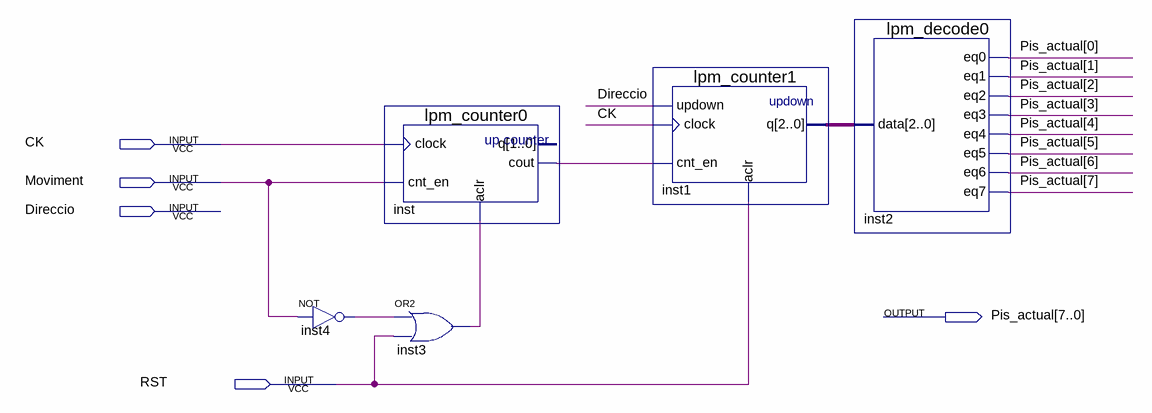
[diagram p0: schematic sheet]
// Quartus schematic Pis.bdf as structural Verilog: 5 symbols, 5 pins
module Pis (
  input  CK,
  input  Moviment,
  input  Direccio,
  input  RST,
  output [7:0] Pis_actual
);

  wire inst3_out, inst4_out, inst_cout;
  wire [2:0] inst1_q;

  not inst4 (inst4_out, Moviment);
  lpm_counter0 inst (.clock(CK), .cnt_en(Moviment), .aclr(inst3_out), .cout(inst_cout));  // open: q
  or inst3 (inst3_out, inst4_out, RST);
  lpm_counter1 inst1 (.updown(Direccio), .clock(CK), .cnt_en(inst_cout), .aclr(RST), .q(inst1_q));
  lpm_decode0 inst2 (
    .data(inst1_q), .eq0(Pis_actual[0]), .eq1(Pis_actual[1]), .eq2(Pis_actual[2]), .eq3(Pis_actual[3]),
    .eq4(Pis_actual[4]), .eq5(Pis_actual[5]), .eq6(Pis_actual[6]), .eq7(Pis_actual[7]));
endmodule
